# Altium schematic sheet Rover_Sensor.SchDoc
size A4
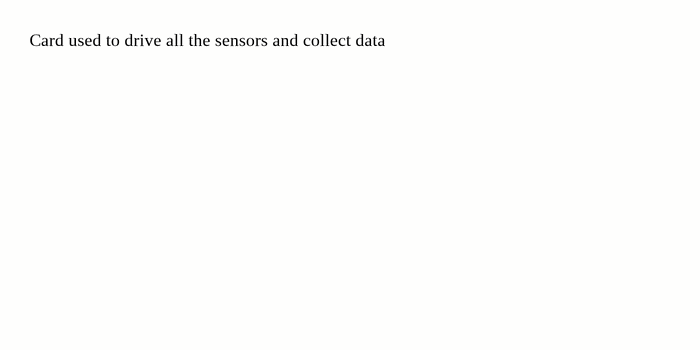
[diagram p0: Rover_Sensor.SchDoc]

## Notes on the sheet
- Card used to drive all the sensors and collect data